# EasyEDA schematic 1-Schematic_供电板和光耦板.json
TITLE: Sheet_1; REV: 1.0; Date: 2019-04-09; Sheet: 1/1; Drawn By: aoyu123; Company: Your Company
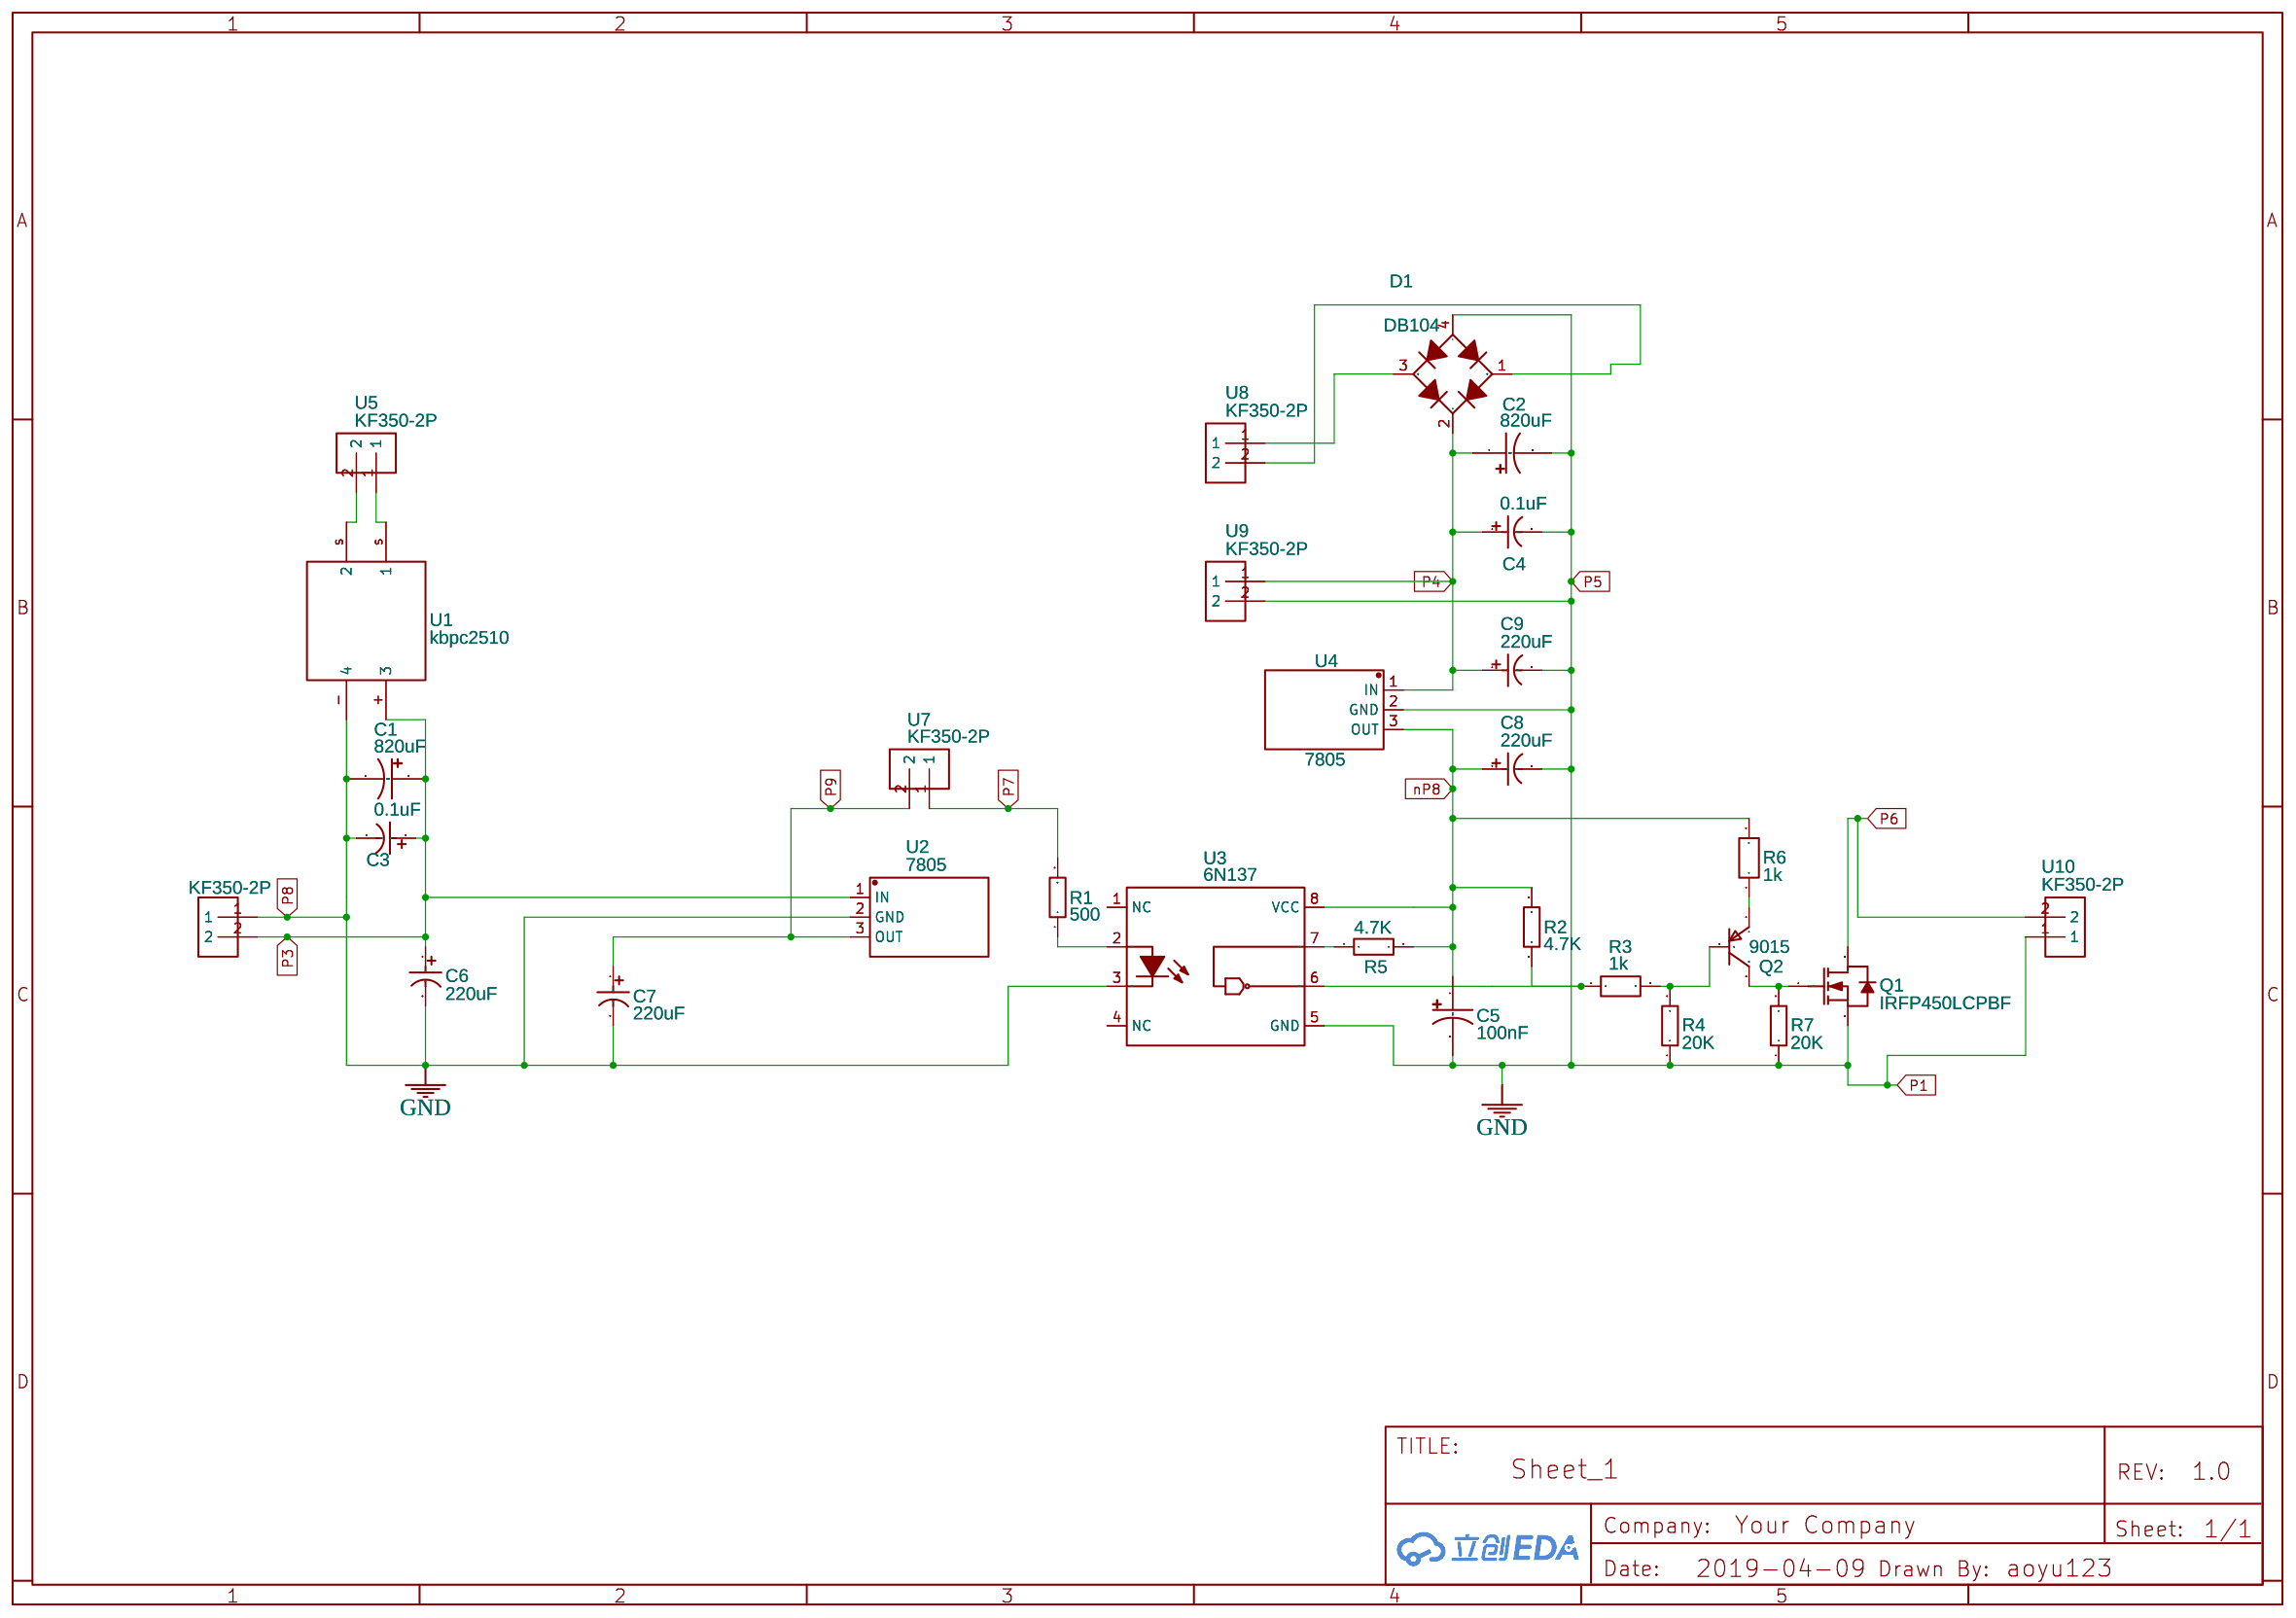
[diagram p0: schematic sheet]

## Parts
C1  820uF  [CAP-GT-6.3*9]
C2  820uF  [CAP-GT-6.3*9]
C3  0.1uF  [CAP-D5.0XF2.0]
C4  0.1uF  [CAP-D5.0XF2.0]
C5  100nF  [CASE-P_2012]
C6  220uF  [CAP-D8.0XF3.5]
C7  220uF  [CAP-D5.0XF2.0]
C8  220uF  [CAP-D8.0XF3.5]
C9  220uF  [CAP-D5.0XF2.0]
D1  DB104  [BRIDGE-DB]
Q1  IRFP450LCPBF  [TO-247(AC)]
Q2  9015  [TO-92(TO-92-3)]
R1  500  [AXIAL-0.4]
R2  4.7K  [AXIAL-0.3]
R3  1k  [AXIAL-0.4]
R4  20K  [AXIAL-0.5]
R5  4.7K  [AXIAL-0.3]
R6  1k  [AXIAL-0.3]
R7  20K  [AXIAL-0.5]
U1  kbpc2510  [KBPC2510]
U2  7805  [TO-220]
U3  6N137  [DIP-8_W8.00MM]
U4  7805  [TO-220]
U5  KF350-2P  [KF350-2P]
U6  KF350-2P  [KF350-2P]
U7  KF350-2P  [KF350-2P]
U8  KF350-2P  [KF350-2P]
U9  KF350-2P  [KF350-2P]
U10  KF350-2P  [KF350-2P]

## Library data of the parts
C1 = HS0J827M0609PC: Supplier: LCSC; Manufacturer: HONOR; Supplier Part: C88708
C2 = HS0E827M0609PC: Supplier: LCSC; Manufacturer: HONOR; Supplier Part: C88707
C3 C4 = 0.1UF 50V: Supplier: LCSC; Manufacturer: ValuePro; Supplier Part: C28061
C5 = TMCP1D104MTRF: Supplier: LCSC; Supplier Part: C154088; Manufacturer: Vishay Intertech; Contributor: LCSC
C6 C8 = 220uF 25V 8*7: Supplier: LCSC; Manufacturer: ValuePro; Supplier Part: C45072
C7 C9 = 220uF 10V 5*11: Supplier: LCSC; Manufacturer: ValuePro; Supplier Part: C43319
D1 = -: Supplier: LCSC; Manufacturer: ValuePro; image: //image.lceda.cn/szlcsc/C9059.jpg; Supplier Part: C9059
Q1 = -: Supplier: LCSC; Manufacturer: IR; Supplier Part: C2684
Q2 = -: Supplier: LCSC; Manufacturer: SEMTECH; Manufacturer Part: 9015C; Contributor: LCSC; Supplier Part: C118555
R1 R3 = Res_AXIAL-0.4(1/4W)_EU: Manufacturer Part: ?
R2 R5 = CFR25SJR-52-4K7: Supplier: LCSC; Supplier Part: C309513; Manufacturer: YAGEO; Contributor: LCSC
R4 R7 = RD50T5203J: Supplier: LCSC; Supplier Part: C167556; Manufacturer: TA-I Tech; Contributor: LCSC
R6 = Res_AXIAL-0.3(1/8W)_EU: Manufacturer Part: ?
U1 = -: Manufacturer Part: ?; Contributor: aoyu123
U2 U4 = -: Supplier: LCSC; Supplier Part: C305416; Manufacturer: Foshan Blue Rocket Elec; Contributor: LCSC
U3 = -: Supplier: LCSC; Manufacturer: EVERLIGHT; Contributor: LCSC; Supplier Part: C142297
U5-U10 = -: Contributor: fxlee

## Nets
GND: C1.2 C2.2 C3.2 C4.2 C5.2 C6.2 C7.2 C8.2 C9.2 D1.4(-) Q1.3(S) R4.1 R7.1 U1.-(4) U2.2(GND) U3.3(CAT) U3.5(GND) U4.2(GND) U6.1 U9.2 U10.1
nP8: C5.1 C8.1 R2.2 R5.2 R6.2 U3.8(VCC) U4.3(OUT)
P3: C1.1 C3.1 C6.1 U1.+(3) U2.1(IN) U6.2
P4: C2.1 C4.1 C9.1 D1.2(+) U4.1(IN) U9.1
P6: Q1.2(D) U10.2
P7: R1.2 U7.1
P9: C7.1 U2.3(OUT) U7.2
Net-(D1-1): D1.1(C1) U8.2
Net-(D1-3): D1.3(C2) U8.1
Net-(Q1-1): Q1.1(G) Q2.3(C) R7.2
Net-(Q2-1): Q2.1(E) R6.1
Net-(Q2-2): Q2.2(B) R3.2 R4.2
Net-(R1-1): R1.1 U3.2(AN)
Net-(R2-1): R2.1 R3.1 U3.6(VOUT)
Net-(R5-1): R5.1 U3.7(VE)
Net-(U1-s): U1.s(2) U5.1 U5.2

Not connected (* = marked no-connect by the designer): U3 1(NC) 4(NC)
